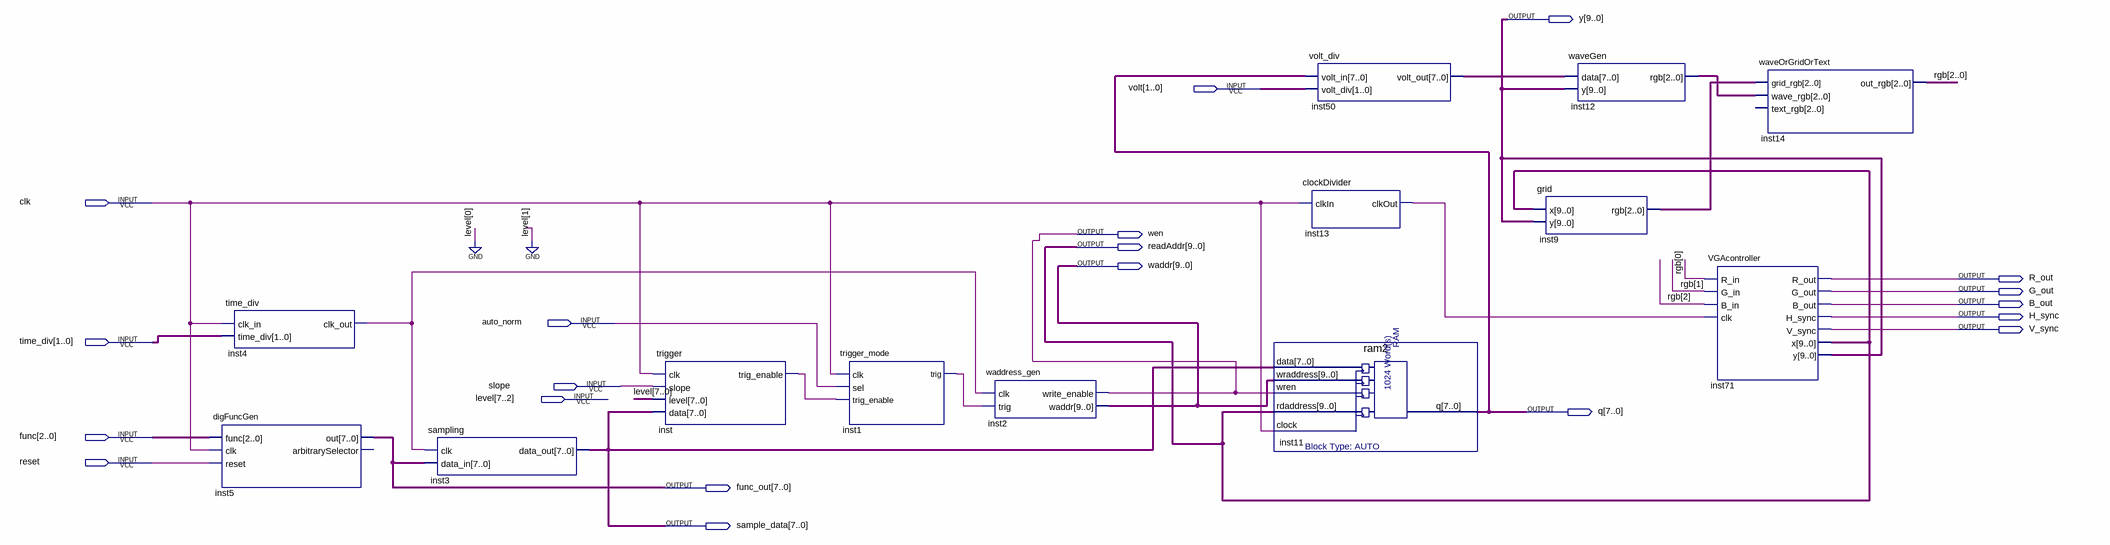
[diagram p0: schematic sheet]
// Quartus schematic Osilloscope.bdf as structural Verilog: 13 symbols, 20 pins
module Osilloscope (
  input  [1:0] volt,
  input  clk,
  input  auto_norm,
  input  [1:0] time_div,
  input  slope,
  input  [7:2] level,
  input  [2:0] func,
  input  reset,
  output [9:0] y,
  output wen,
  output [9:0] readAddr,
  output [9:0] waddr,
  output R_out,
  output G_out,
  output B_out,
  output H_sync,
  output V_sync,
  output [7:0] q,
  output [7:0] func_out,
  output [7:0] sample_data
);

  wire inst1_trig, inst4_clk_out, inst13_clkout, inst_trig_enable;
  wire [2:0] inst9_rgb, inst12_rgb, rgb;
  wire [7:0] inst50_volt_out;

  time_div inst4 (.clk_in(clk), .time_div(time_div), .clk_out(inst4_clk_out));
  digFuncGen inst5 (.func(func), .clk(clk), .reset(reset), .out(func_out));  // open: arbitrarySelector
  sampling inst3 (.clk(inst4_clk_out), .data_in(func_out), .data_out(sample_data));
  trigger inst (.clk(clk), .slope(slope), .level({level, 2'b00}), .data(sample_data), .trig_enable(inst_trig_enable));
  trigger_mode inst1 (.clk(clk), .sel(auto_norm), .trig_enable(inst_trig_enable), .trig(inst1_trig));
  waddress_gen inst2 (.clk(inst4_clk_out), .trig(inst1_trig), .write_enable(wen), .waddr(waddr));
  ram2 inst11 (.data(sample_data), .wraddress(waddr), .wren(wen), .rdaddress(readAddr), .clock(clk), .q(q));
  volt_div inst50 (.volt_in(q), .volt_div(volt), .volt_out(inst50_volt_out));
  clockDivider inst13 (.clkIn(clk), .clkOut(inst13_clkout));
  grid inst9 (.x(readAddr), .y(y), .rgb(inst9_rgb));
  waveGen inst12 (.data(inst50_volt_out), .y(y), .rgb(inst12_rgb));
  VGAcontroller inst71 (
    .R_in(rgb[0]), .G_in(rgb[1]), .B_in(rgb[2]), .clk(inst13_clkout), .R_out(R_out), .G_out(G_out),
    .B_out(B_out), .H_sync(H_sync), .V_sync(V_sync), .x(readAddr), .y(y));
  waveOrGridOrText inst14 (.grid_rgb(inst9_rgb), .wave_rgb(inst12_rgb), .out_rgb(rgb));  // open: text_rgb
endmodule
